# EAGLE design test2 (EAGLE 9.6.2)
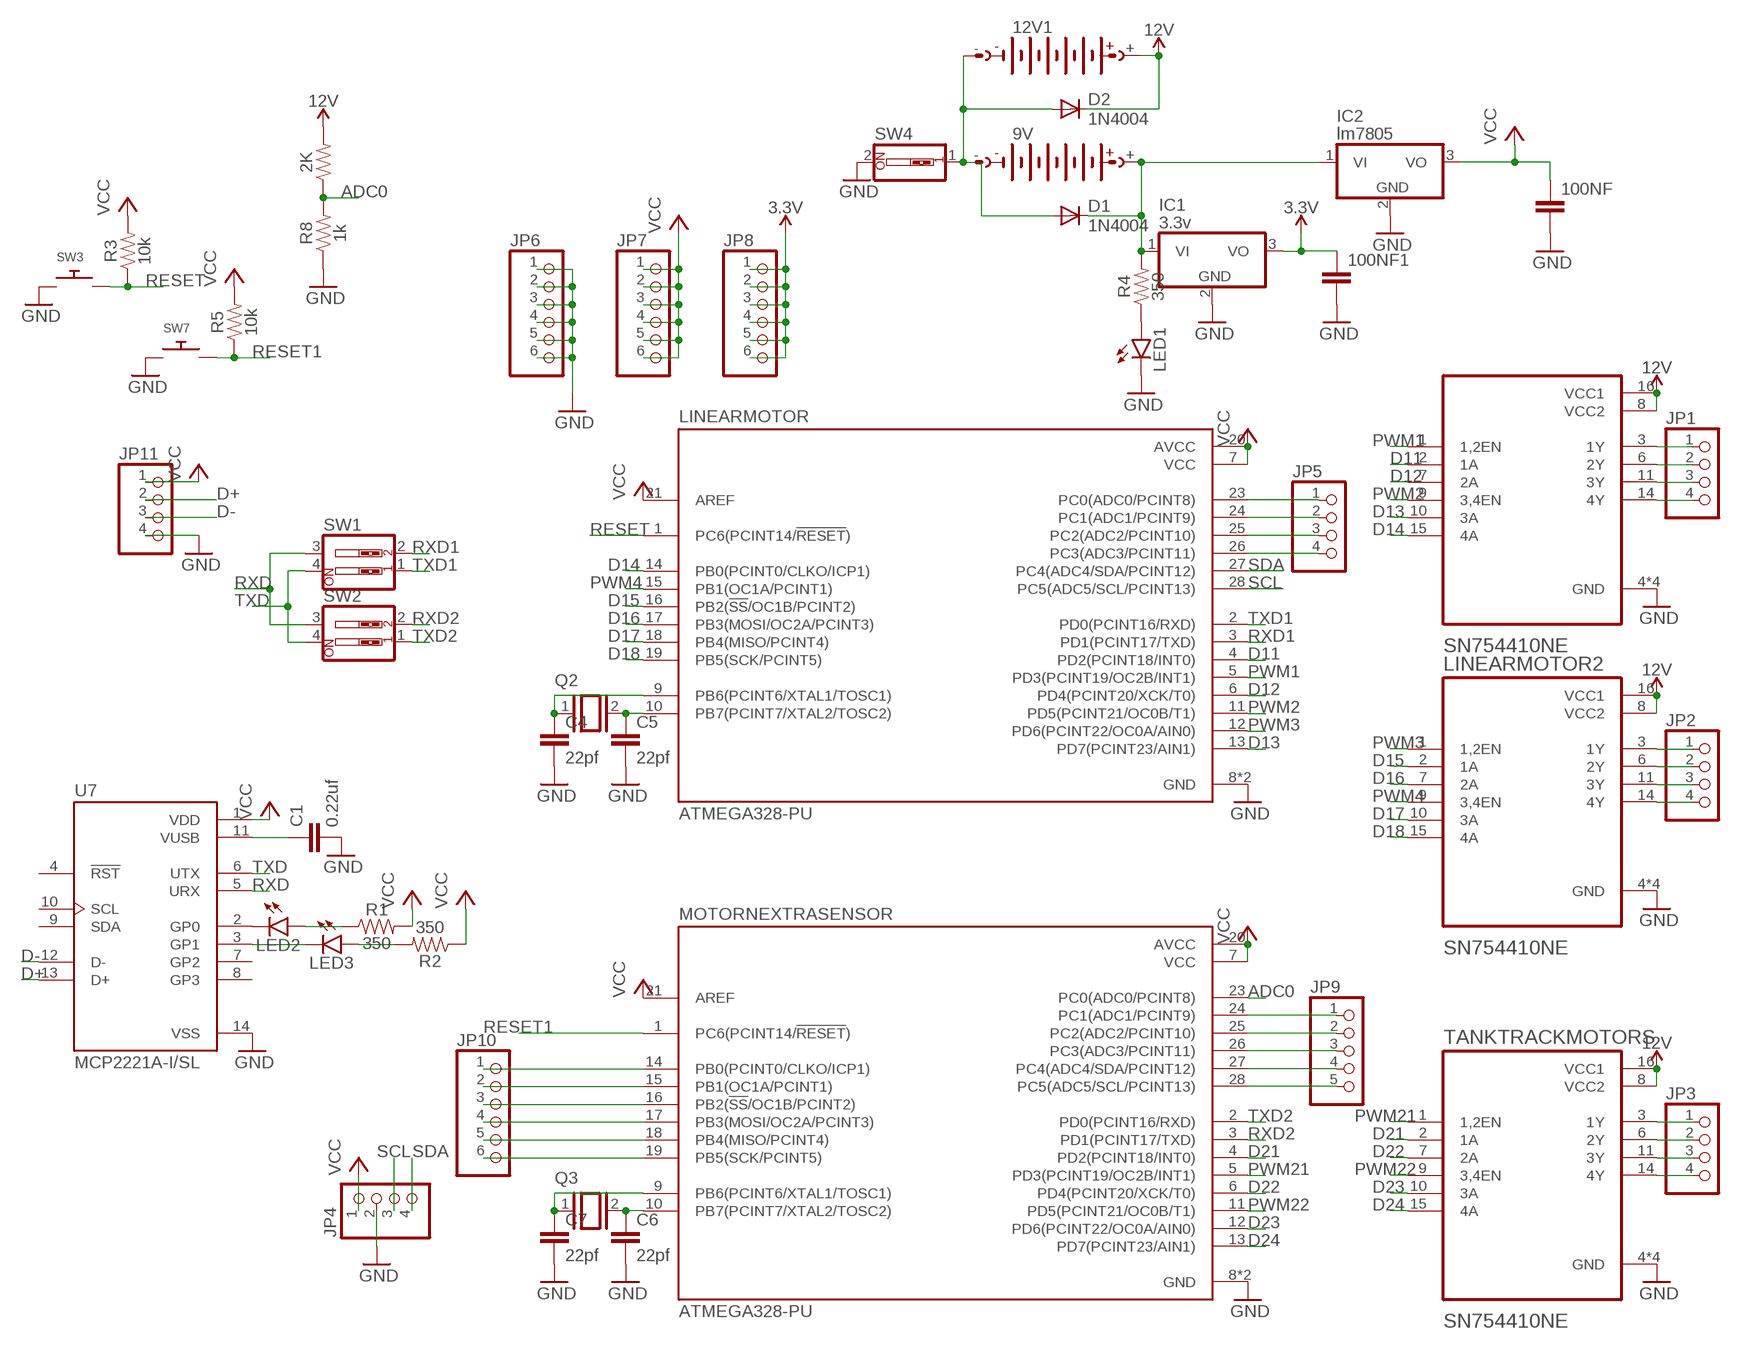
[diagram p0: schematic, sheet 1]

## Parts
2K  2k  1KOHM-HORIZ-1/4W-1%  [AXIAL-0.3]
9V  AB9V  [AB9V]
12V1  AB9V  [AB9V]
100NF  330nF  10NF-PTH-10MM-10000V-1-%  [CAP-PTH-10MM]
100NF1  330nF  10NF-PTH-10MM-10000V-1-%  [CAP-PTH-10MM]
C1  0.22uf  10NF-PTH-10MM-10000V-1-%  [CAP-PTH-10MM]
C4  22pf  10NF-PTH-10MM-10000V-1-%  [CAP-PTH-10MM]
C5  22pf  10NF-PTH-10MM-10000V-1-%  [CAP-PTH-10MM]
C6  22pf  10NF-PTH-10MM-10000V-1-%  [CAP-PTH-10MM]
C7  22pf  10NF-PTH-10MM-10000V-1-%  [CAP-PTH-10MM]
D1  1N4004  [DO41-10]
D2  1N4004  [DO41-10]
IC1  3.3v  788TV  [TO220V]
IC2  lm7805  788TV  [TO220V]
JP1  PINHD-1X4  [1X04]
JP2  PINHD-1X4  [1X04]
JP3  PINHD-1X4  [1X04]
JP4  PINHD-1X4  [1X04]
JP5  PINHD-1X4  [1X04]
JP6  PINHD-1X6  [1X06]
JP7  PINHD-1X6  [1X06]
JP8  PINHD-1X6  [1X06]
JP9  PINHD-1X5  [1X05]
JP10  PINHD-1X6  [1X06]
JP11  PINHD-1X4  [1X04]
LED1  LED3MM  [LED3MM]
LED2  LED3MM  [LED3MM]
LED3  LED3MM  [LED3MM]
LINEARMOTOR  ATMEGA328-PU  [DIP787W46P254L3467H508Q28]
LINEARMOTOR1  SN754410NE  [DIP762W45P254L1980H508Q16]
LINEARMOTOR2  SN754410NE  [DIP762W45P254L1980H508Q16]
MOTORNEXTRASENSOR  ATMEGA328-PU  [DIP787W46P254L3467H508Q28]
Q2  XTAL/S  [QS]
Q3  XTAL/S  [QS]
R1  350  1KOHM-HORIZ-1/4W-1%  [AXIAL-0.3]
R2  350  1KOHM-HORIZ-1/4W-1%  [AXIAL-0.3]
R3  10k  10KOHM-HORIZ-1/4W-1%  [AXIAL-0.3]
R4  350  1KOHM-HORIZ-1/4W-1%  [AXIAL-0.3]
R5  10k  10KOHM-HORIZ-1/4W-1%  [AXIAL-0.3]
R8  1k  1KOHM-HORIZ-1/4W-1%  [AXIAL-0.3]
SW1  SW_DIP-2  [EDG-02]
SW2  SW_DIP-2  [EDG-02]
SW3  SWITCH_PUSHBUTTONEVQ-PE  [TACT_PANA-EVQ]
SW4  SW_DIP-1  [EDG-01]
SW7  SWITCH_PUSHBUTTONEVQ-PE  [TACT_PANA-EVQ]
TANKTRACKMOTORS  SN754410NE  [DIP762W45P254L1980H508Q16]
U7  MCP2221A-I/SL  [SOIC127P600X175-14N]

## Nets
3.3V: 100NF1.1 IC1.3(VO) JP8.1 JP8.2 JP8.3 JP8.4 JP8.5 JP8.6
12V: 2K.P$2 12V1.+ D2.C LINEARMOTOR1.8(VCC2) LINEARMOTOR1.16(VCC1) LINEARMOTOR2.8(VCC2) LINEARMOTOR2.16(VCC1) TANKTRACKMOTORS.8(VCC2) TANKTRACKMOTORS.16(VCC1)
ADC0: 2K.P$1 MOTORNEXTRASENSOR.23(PC0(ADC0/PCINT8)) R8.P$2
D11: LINEARMOTOR1.2(1A) LINEARMOTOR.4(PD2(PCINT18/INT0))
D12: LINEARMOTOR1.7(2A) LINEARMOTOR.6(PD4(PCINT20/XCK/T0))
D13: LINEARMOTOR1.10(3A) LINEARMOTOR.13(PD7(PCINT23/AIN1))
D14: LINEARMOTOR1.15(4A) LINEARMOTOR.14(PB0(PCINT0/CLKO/ICP1))
D15: LINEARMOTOR2.2(1A) LINEARMOTOR.16(PB2(!SS!/OC1B/PCINT2))
D16: LINEARMOTOR2.7(2A) LINEARMOTOR.17(PB3(MOSI/OC2A/PCINT3))
D17: LINEARMOTOR2.10(3A) LINEARMOTOR.18(PB4(MISO/PCINT4))
D18: LINEARMOTOR2.15(4A) LINEARMOTOR.19(PB5(SCK/PCINT5))
D21: MOTORNEXTRASENSOR.4(PD2(PCINT18/INT0)) TANKTRACKMOTORS.2(1A)
D22: MOTORNEXTRASENSOR.6(PD4(PCINT20/XCK/T0)) TANKTRACKMOTORS.7(2A)
D23: MOTORNEXTRASENSOR.12(PD6(PCINT22/OC0A/AIN0)) TANKTRACKMOTORS.10(3A)
D24: MOTORNEXTRASENSOR.13(PD7(PCINT23/AIN1)) TANKTRACKMOTORS.15(4A)
D+: JP11.2 U7.13(D+)
D-: JP11.3 U7.12(D-)
GND: 100NF1.2 100NF.2 C1.2 C4.2 C5.2 C6.2 C7.2 IC1.2(GND) IC2.2(GND) JP4.2 JP6.1 JP6.2 JP6.3 JP6.4 JP6.5 JP6.6 JP11.4 LED1.K(C) LINEARMOTOR1.4(GND) LINEARMOTOR1.5(GND) LINEARMOTOR1.12(GND) LINEARMOTOR1.13(GND) LINEARMOTOR2.4(GND) LINEARMOTOR2.5(GND) LINEARMOTOR2.12(GND) LINEARMOTOR2.13(GND) LINEARMOTOR.8(GND) LINEARMOTOR.22(GND) MOTORNEXTRASENSOR.8(GND) MOTORNEXTRASENSOR.22(GND) R8.P$1 SW3.P$1 SW4.2 SW7.P$1 TANKTRACKMOTORS.4(GND) TANKTRACKMOTORS.5(GND) TANKTRACKMOTORS.12(GND) TANKTRACKMOTORS.13(GND) U7.14(VSS)
N$1: C1.1 U7.11(VUSB)
N$2: LED2.K(C) U7.2(GP0)
N$3: LED3.K(C) U7.3(GP1)
N$4: LED2.A R1.P$1
N$5: LED3.A R2.P$2
N$6: C6.1 MOTORNEXTRASENSOR.10(PB7(PCINT7/XTAL2/TOSC2)) Q3.2
N$7: C7.1 MOTORNEXTRASENSOR.9(PB6(PCINT6/XTAL1/TOSC1)) Q3.1
N$8: C4.1 LINEARMOTOR.9(PB6(PCINT6/XTAL1/TOSC1)) Q2.1
N$10: JP9.1 MOTORNEXTRASENSOR.24(PC1(ADC1/PCINT9))
N$11: C5.1 LINEARMOTOR.10(PB7(PCINT7/XTAL2/TOSC2)) Q2.2
N$12: JP1.1 LINEARMOTOR1.3(1Y)
N$13: JP1.2 LINEARMOTOR1.6(2Y)
N$14: JP1.3 LINEARMOTOR1.11(3Y)
N$15: JP1.4 LINEARMOTOR1.14(4Y)
N$16: JP2.1 LINEARMOTOR2.3(1Y)
N$17: JP2.2 LINEARMOTOR2.6(2Y)
N$18: JP2.3 LINEARMOTOR2.11(3Y)
N$19: JP2.4 LINEARMOTOR2.14(4Y)
N$20: JP3.1 TANKTRACKMOTORS.3(1Y)
N$21: JP3.2 TANKTRACKMOTORS.6(2Y)
N$22: JP3.3 TANKTRACKMOTORS.11(3Y)
N$23: JP3.4 TANKTRACKMOTORS.14(4Y)
N$24: JP5.1 LINEARMOTOR.23(PC0(ADC0/PCINT8))
N$25: JP5.2 LINEARMOTOR.24(PC1(ADC1/PCINT9))
N$26: JP5.3 LINEARMOTOR.25(PC2(ADC2/PCINT10))
N$27: JP5.4 LINEARMOTOR.26(PC3(ADC3/PCINT11))
N$28: JP9.2 MOTORNEXTRASENSOR.25(PC2(ADC2/PCINT10))
N$29: JP9.3 MOTORNEXTRASENSOR.26(PC3(ADC3/PCINT11))
N$30: JP10.1 MOTORNEXTRASENSOR.14(PB0(PCINT0/CLKO/ICP1))
N$31: JP10.2 MOTORNEXTRASENSOR.15(PB1(OC1A/PCINT1))
N$32: JP10.3 MOTORNEXTRASENSOR.16(PB2(!SS!/OC1B/PCINT2))
N$33: JP10.4 MOTORNEXTRASENSOR.17(PB3(MOSI/OC2A/PCINT3))
N$34: JP10.5 MOTORNEXTRASENSOR.18(PB4(MISO/PCINT4))
N$35: JP9.4 MOTORNEXTRASENSOR.27(PC4(ADC4/SDA/PCINT12))
N$36: JP9.5 MOTORNEXTRASENSOR.28(PC5(ADC5/SCL/PCINT13))
N$37: 9V.+ D1.C IC1.1(VI) IC2.1(VI) R4.P$2
N$38: JP10.6 MOTORNEXTRASENSOR.19(PB5(SCK/PCINT5))
N$40: LED1.A R4.P$1
N$41: 9V.- 12V1.- D1.A D2.A SW4.1
PWM1: LINEARMOTOR1.1(1,2EN) LINEARMOTOR.5(PD3(PCINT19/OC2B/INT1))
PWM2: LINEARMOTOR1.9(3,4EN) LINEARMOTOR.11(PD5(PCINT21/OC0B/T1))
PWM3: LINEARMOTOR2.1(1,2EN) LINEARMOTOR.12(PD6(PCINT22/OC0A/AIN0))
PWM4: LINEARMOTOR2.9(3,4EN) LINEARMOTOR.15(PB1(OC1A/PCINT1))
PWM21: MOTORNEXTRASENSOR.5(PD3(PCINT19/OC2B/INT1)) TANKTRACKMOTORS.1(1,2EN)
PWM22: MOTORNEXTRASENSOR.11(PD5(PCINT21/OC0B/T1)) TANKTRACKMOTORS.9(3,4EN)
RESET: LINEARMOTOR.1(PC6(PCINT14/!RESET!)) R3.P$1 SW3.P$2
RESET1: MOTORNEXTRASENSOR.1(PC6(PCINT14/!RESET!)) R5.P$1 SW7.P$2
RXD: SW1.3 SW2.3 U7.5(URX)
RXD1: LINEARMOTOR.3(PD1(PCINT17/TXD)) SW1.2
RXD2: MOTORNEXTRASENSOR.3(PD1(PCINT17/TXD)) SW2.2
SCL: JP4.3 LINEARMOTOR.28(PC5(ADC5/SCL/PCINT13))
SDA: JP4.4 LINEARMOTOR.27(PC4(ADC4/SDA/PCINT12))
TXD: SW1.4 SW2.4 U7.6(UTX)
TXD1: LINEARMOTOR.2(PD0(PCINT16/RXD)) SW1.1
TXD2: MOTORNEXTRASENSOR.2(PD0(PCINT16/RXD)) SW2.1
VCC: 100NF.1 IC2.3(VO) JP4.1 JP7.1 JP7.2 JP7.3 JP7.4 JP7.5 JP7.6 JP11.1 LINEARMOTOR.7(VCC) LINEARMOTOR.20(AVCC) LINEARMOTOR.21(AREF) MOTORNEXTRASENSOR.7(VCC) MOTORNEXTRASENSOR.20(AVCC) MOTORNEXTRASENSOR.21(AREF) R1.P$2 R2.P$1 R3.P$2 R5.P$2 U7.1(VDD)
Unconnected: U7.4(!RST) U7.7(GP2) U7.8(GP3) U7.9(SDA) U7.10(SCL)

## Library data of the parts
2K R1 R2 R4 = SparkFun-Resistors:1KOHM: 1kΩ resistor A resistor is a passive two-terminal electrical component that implements electrical resistance as a circuit element. Resistors act to reduce current flow, and, at the same time, act to lower voltage levels within circuits. - Wikipedia; PROD_ID: RES-12182; VALUE: 1k
9V 12V1 = battery:AB9V: 9-V BATTERY CLIP
100NF 100NF1 C1 C4-C7 = SparkFun-Capacitors:10NF: 0.01uF/10nF/10,000pF ceramic capacitors A capacitor is a passive two-terminal electrical component used to store electrical energy temporarily in an electric field. CAP-09321; PROD_ID: CAP-09321; VALUE: 10nF
D1 D2 = adafruit:1N4004: DIODE General purpose 1N400x type rectifier (With bigger pads) http://www.ladyada.net/library/pcb/eaglelibrary.html
IC1 IC2 = linear:78*: Positive VOLTAGE REGULATOR Source: http://cache.national.com/ds/LM/LM78L05.pdf http://www.fairchildsemi.com/ds/LM/LM7805.pdf
JP1-JP5 JP11 = pinhead:PINHD-1X4: PIN HEADER
JP6-JP8 JP10 = pinhead:PINHD-1X6: PIN HEADER
JP9 = pinhead:PINHD-1X5: PIN HEADER
LED1-LED3 = led:LED: LED OSRAM: - CHIPLED LG R971, LG N971, LY N971, LG Q971, LY Q971, LO R971, LY R971 LH N974, LH R974 LS Q976, LO Q976, LY Q976 LO Q996 - Hyper CHIPLED LW Q18S LB Q993, LB Q99A, LB R99A - SideLED LS A670, LO A670, LY A670, LG A670, LP A670 LB A673, LV A673, LT A673, LW A673 LH A674 LY A675 LS A676, LA A676, LO A676, LY A676, LW A676 LS A679, LY A679, LG A679 - Hyper Micro SIDELED® LS Y876, LA Y876, LO Y876, LY Y876 LT Y87S - SmartLED LW L88C, LW L88S LB L89C, LB L89S, LG L890 LS L89K, LO L89K, LY L89K LS L896, LA L896, LO L896, LY L896 - TOPLED LS T670, LO T670, LY T670, LG T670, LP T670 LSG T670, LSP T670, LSY T670, LOP T670, LYG T670 LG T671, LOG T671, LSG T671 LB T673, LV T673, LT T673, LW T673 LH T674 LS T676, LA T676, LO T676, LY T676, LB T676, LH T676, LSB T676, LW T676 LB T67C, LV T67C, LT T67C, LS T67K, LO T67K, LY T67K, LW E67C LS E67B, LA E67B, LO E67B, LY E67B, LB E67C, LV E67C, LT E67C LW T67C LS T679, LY T679, LG T679 LS T770, LO T770, LY T770, LG T770, LP T770 LB T773, LV T773, LT T773, LW T773 LH T774 LS E675, LA E675, LY E675, LS T675 LS T776, LA T776, LO T776, LY T776, LB T776 LHGB T686 LT T68C, LB T68C - Hyper Mini TOPLED® LB M676 - Mini TOPLED Santana® LG M470 LS M47K, LO M47K, LY M47K Source: http://www.osram.convergy.de LUXEON: - LUMILED® LXK2-PW12-R00, LXK2-PW12-S00, LXK2-PW14-U00, LXK2-PW14-V00 LXK2-PM12-R00, LXK2-PM12-S00, LXK2-PM14-U00 LXK2-PE12-Q00, LXK2-PE12-R00, LXK2-PE12-S00, LXK2-PE14-T00, LXK2-PE14-U00 LXK2-PB12-K00, LXK2-PB12-L00, LXK2-PB12-M00, LXK2-PB14-N00, LXK2-PB14-P00, LXK2-PB14-Q00 LXK2-PR12-L00, LXK2-PR12-M00, LXK2-PR14-Q00, LXK2-PR14-R00 LXK2-PD12-Q00, LXK2-PD12-R00, LXK2-PD12-S00 LXK2-PH12-R00, LXK2-PH12-S00 LXK2-PL12-P00, LXK2-PL12-Q00, LXK2-PL12-R00 Source: www.luxeon.com KINGBRIGHT: KA-3528ASYC Source: www.kingbright.com
LINEARMOTOR MOTORNEXTRASENSOR = ATMEGA328-PU:ATMEGA328-PU: Check availability <https://pricing.snapeda.com/parts/ATMEGA328-PU/Microchip%20Technology/view-part?ref=eda>; AVAILABILITY: In Stock; CHECK_PRICES: https://www.snapeda.com/parts/ATMEGA328-PU/Microchip/view-part/?ref=eda; DESCRIPTION: AVR AVR® ATmega Microcontroller IC 8-Bit 20MHz 32KB (16K x 16) FLASH 28-PDIP; MF: Microchip Technology; MP: ATMEGA328-PU; PACKAGE: DIP-28 Microchip Technology; PRICE: None; PURCHASE-URL: https://www.snapeda.com/api/url_track_click_mouser/?unipart_id=4833845&manufacturer=Microchip Technology&part_name=ATMEGA328-PU&search_term=None; SNAPEDA_LINK: https://www.snapeda.com/parts/ATMEGA328-PU/Microchip/view-part/?ref=snap
LINEARMOTOR1 LINEARMOTOR2 TANKTRACKMOTORS = SN754410NE:SN754410NE: Check availability <https://pricing.snapeda.com/parts/SN754410NE/Texas%20Instruments/view-part?ref=eda>; AVAILABILITY: In Stock; CHECK_PRICES: https://www.snapeda.com/parts/SN754410NE/Texas+Instruments/view-part/?ref=eda; DESCRIPTION: Quadruple Half-H Drivers; MF: Texas Instruments; MP: SN754410NE; PACKAGE: PDIP-16 Texas Instruments; PRICE: None; PURCHASE-URL: https://www.snapeda.com/api/url_track_click_mouser/?unipart_id=285165&manufacturer=Texas Instruments&part_name=SN754410NE&search_term=None; SNAPEDA_LINK: https://www.snapeda.com/parts/SN754410NE/Texas+Instruments/view-part/?ref=snap
Q2 Q3 = special:XTAL/S: CRYSTAL
R3 R5 = SparkFun-Resistors:10KOHM: 10kΩ resistor A resistor is a passive two-terminal electrical component that implements electrical resistance as a circuit element. Resistors act to reduce current flow, and, at the same time, act to lower voltage levels within circuits. - Wikipedia; PROD_ID: RES-12183
R8 = SparkFun-Resistors:1KOHM: 1kΩ resistor A resistor is a passive two-terminal electrical component that implements electrical resistance as a circuit element. Resistors act to reduce current flow, and, at the same time, act to lower voltage levels within circuits. - Wikipedia; PROD_ID: RES-12182
SW1 SW2 = special:SW_DIP-2: DIP SWITCH
SW3 SW7 = adafruit:SWITCH_PUSHBUTTON: Buttons SOFTTOUCHSMD_SJ - Soft touch temporary push button (Super Junk Akihabara) Compatible with SKPMANE010 [Mouser: 688-SKPMAN] C&K_KSS = Digikey: KSS221GLFS
SW4 = special:SW_DIP-1: DIP SWITCH
U7 = MCP2221A-I_SL:MCP2221A-I/SL: USB 2.0-to-I2C/UART/SMBus Protocol Converter with GPIO (Master Mode) Check availability <https://pricing.snapeda.com/parts/MCP2221A-I/SL/Microchip/view-part?ref=eda>; AVAILABILITY: In Stock; CHECK_PRICES: https://www.snapeda.com/parts/MCP2221A-I/SL/Microchip/view-part/?ref=eda; DESCRIPTION: USB Bridge, USB to I²C/UART USB 2.0 I²C, UART Interface 14-SOIC; MF: Microchip; MP: MCP2221A-I/SL; PACKAGE: SO-14 Microchip; PRICE: None; PURCHASE-URL: https://www.snapeda.com/api/url_track_click_mouser/?unipart_id=561316&manufacturer=Microchip&part_name=MCP2221A-I/SL&search_term=None; SNAPEDA_LINK: https://www.snapeda.com/parts/MCP2221A-I/SL/Microchip/view-part/?ref=snap

## Board
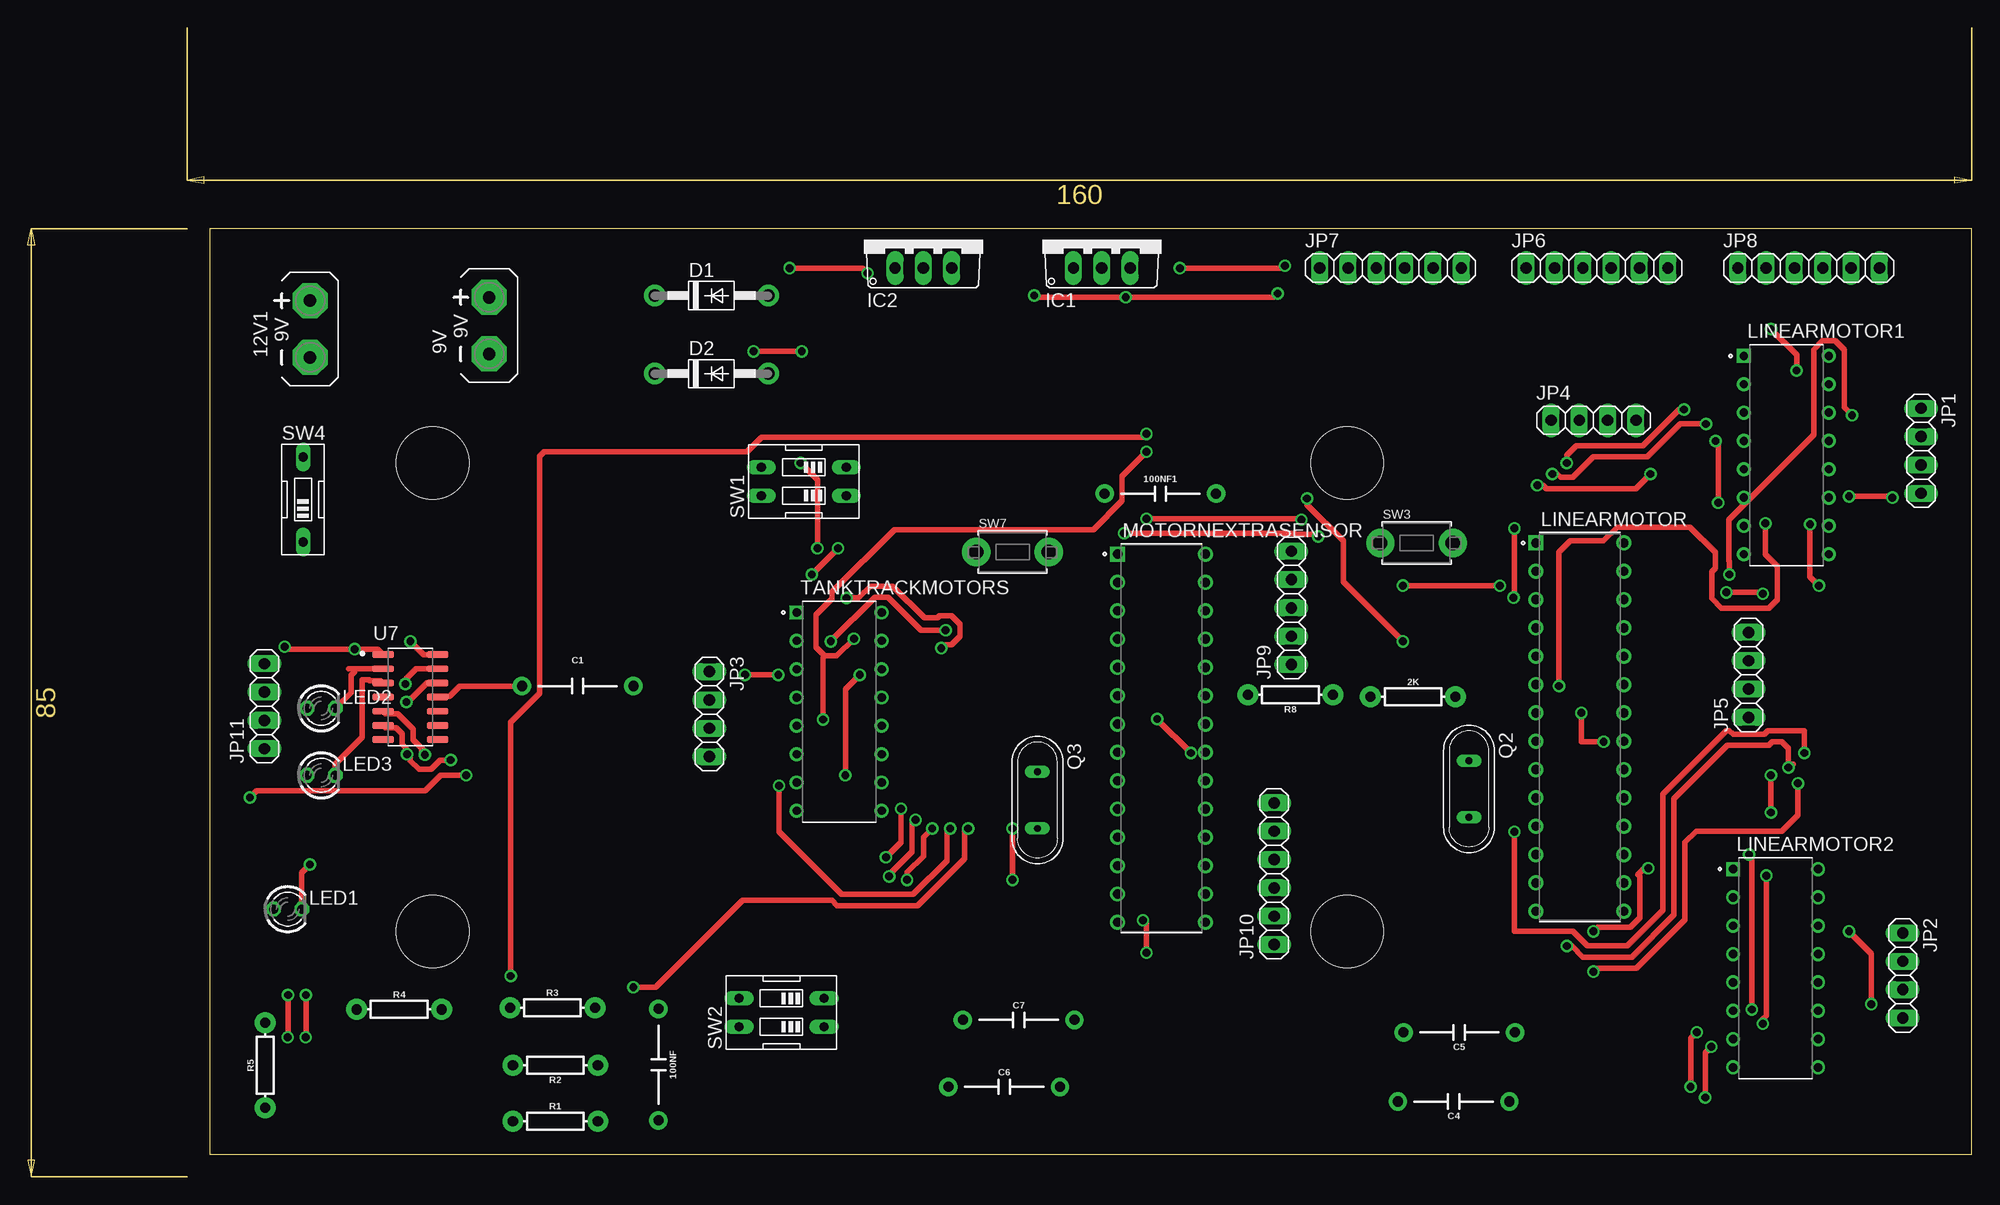
[diagram p1: board, top side]
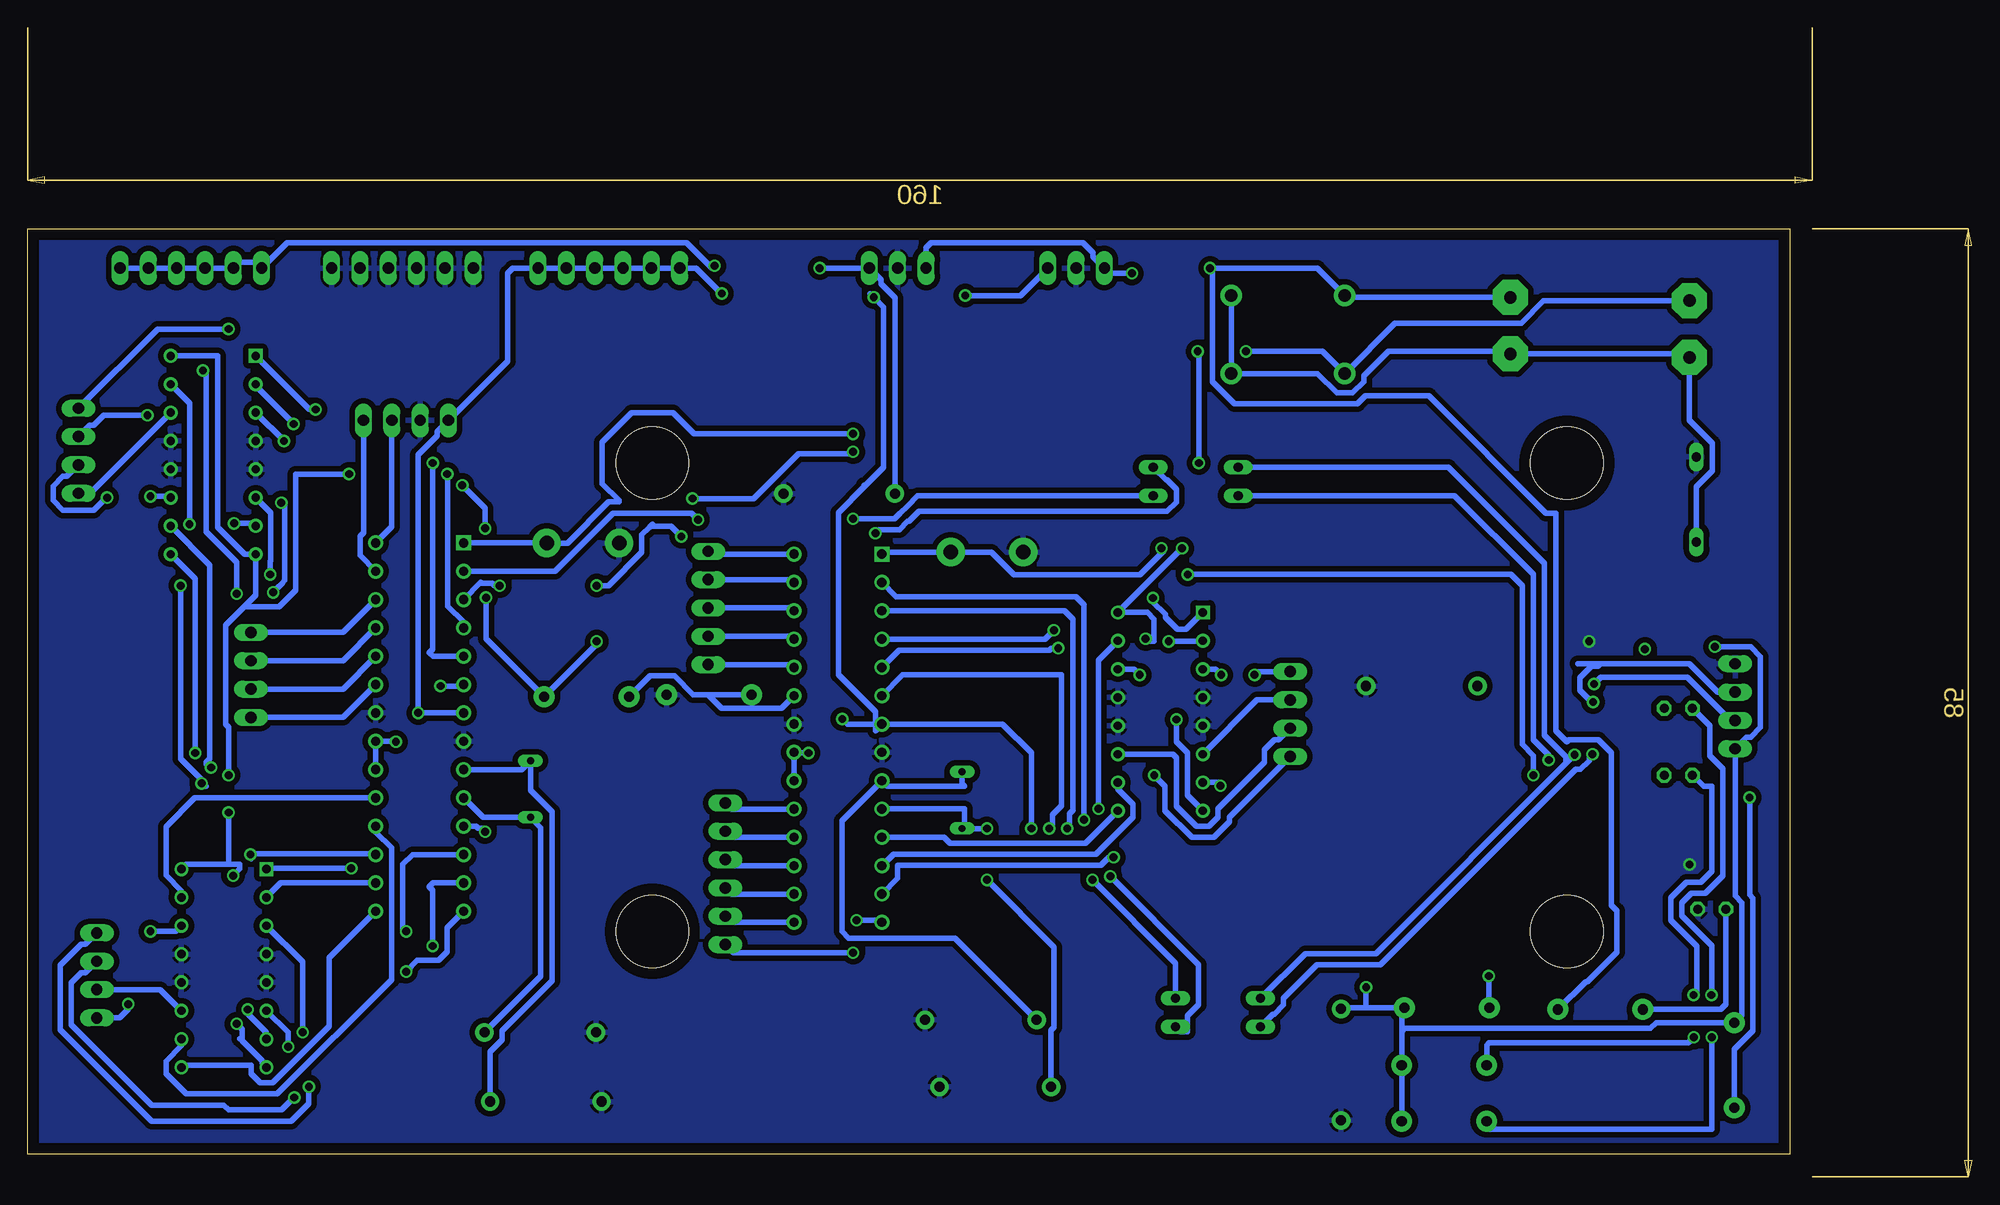
[diagram p2: board, bottom side, seen from below]

Size 158 x 83 mm. Coordinates in mm from the lower left corner, seen from the top.
Outline: 0,0 158,0 158,83 0,83 0,0
Copper layers (1*16): Top 0.035mm / dielectric 1.5mm / Bottom 0.035mm
Design rules "UWE_Router_Std_SS&DS": minimum track width 0.5mm, minimum drill 0.7mm, track to track 0.5mm, track to pad 0.5mm, pad to pad 0.5mm, via to via 0.5mm, smd to smd 0.5mm, copper to edge 1mm, drill to drill 0.2mm, minimum pad ring 10mil, minimum via ring 8mil, stop-mask expansion 4mil, vias tented up to drill 0mil, thermal gap 0.25mm
Holes 6.5 mm at 102,62 20,62 20,20 102,20

### Footprints (pad centres in the part's own frame; a part is rotated, then mirrored left to right if it is on the bottom)
AXIAL-0.3 = drill 0.9 pad 1.88: P$1 -3.81,0; P$2 3.81,0
AB9V = drill 1.118 pad 3.15 octagon: + 0,2.54; - 0,-2.54
CAP-PTH-10MM = drill 0.9 pad 1.651: 1 -5,0; 2 5,0
DO41-10 = drill 1.118 pad 1.93: A 5.08,0; C -5.08,0
TO220V = drill 1.016 long: 1 -2.54,-2.54; 2 0,-2.54; 3 2.54,-2.54
1X04 = drill 1.016 long: 1 -3.81,0; 2 -1.27,0; 3 1.27,0; 4 3.81,0
1X06 = drill 1.016 long: 1 -6.35,0; 2 -3.81,0; 3 -1.27,0; 4 1.27,0; 5 3.81,0; 6 6.35,0
1X05 = drill 1.016 long: 1 -5.08,0; 2 -2.54,0; 3 0,0; 4 2.54,0; 5 5.08,0
LED3MM = drill 0.813 octagon: A -1.27,0; K 1.27,0
DIP787W46P254L3467H508Q28 = drill 0.83 pad 1.25 square: 1 -3.937,16.51 | drill 0.83 pad 1.25: 2 -3.937,13.97; 3 -3.937,11.43; 4 -3.937,8.89; 5 -3.937,6.35; 6 -3.937,3.81; 7 -3.937,1.27; 8 -3.937,-1.27; 9 -3.937,-3.81; 10 -3.937,-6.35; 11 -3.937,-8.89; 12 -3.937,-11.43; 13 -3.937,-13.97; 14 -3.937,-16.51; 15 3.937,-16.51; 16 3.937,-13.97; 17 3.937,-11.43; 18 3.937,-8.89; 19 3.937,-6.35; 20 3.937,-3.81; 21 3.937,-1.27; 22 3.937,1.27; 23 3.937,3.81; 24 3.937,6.35; 25 3.937,8.89; 26 3.937,11.43; 27 3.937,13.97; 28 3.937,16.51
DIP762W45P254L1980H508Q16 = drill 0.74 square: 1 -3.81,8.89 | drill 0.74: 2 -3.81,6.35; 3 -3.81,3.81; 4 -3.81,1.27; 5 -3.81,-1.27; 6 -3.81,-3.81; 7 -3.81,-6.35; 8 -3.81,-8.89; 9 3.81,-8.89; 10 3.81,-6.35; 11 3.81,-3.81; 12 3.81,-1.27; 13 3.81,1.27; 14 3.81,3.81; 15 3.81,6.35; 16 3.81,8.89
QS = drill 0.61 long: 1 -2.54,0; 2 2.54,0
EDG-02 = drill 0.813 long: 1 -1.27,-3.81; 2 1.27,-3.81; 3 1.27,3.81; 4 -1.27,3.81
TACT_PANA-EVQ = drill 1.3 pad 2.54: P$1 -3.25,0; P$2 3.25,0
EDG-01 = drill 0.813 long: 1 0,-3.81; 2 0,3.81
SOIC127P600X175-14N = smd 1.91 x 0.6: 1 -2.46,3.81; 2 -2.46,2.54; 3 -2.46,1.27; 4 -2.46,0; 5 -2.46,-1.27; 6 -2.46,-2.54; 7 -2.46,-3.81; 8 2.46,-3.81; 9 2.46,-2.54; 10 2.46,-1.27; 11 2.46,0; 12 2.46,1.27; 13 2.46,2.54; 14 2.46,3.81

### Placement (x,y rotation side)
2K  107.91,41.03 0 top
9V  25.06,74.31 0 top
12V1  9,74 0 top
100NF  40.25,8.05 270 top
100NF1  85.25,59.25 0 top
C1  33,42 0 top
C4  111.55,4.75 180 top
C5  112.05,10.94 180 top
C6  71.25,6.06 0 top
C7  72.55,12.06 0 top
D1  45,77 0 top
D2  45,70 0 top
IC1  80,82 0 top
IC2  64,82 0 top
JP1  153.47,63.09 270 top
JP2  151.82,16.05 270 top
JP3  44.82,39.48 270 top
JP4  124.09,65.82 0 top
JP5  138,43 90 top
JP6  124.41,79.47 0 top
JP7  105.9,79.47 0 top
JP8  143.39,79.47 0 top
JP9  97,49 90 top
JP10  95.45,25.17 90 top
JP11  4.91,40.19 90 top
LED1  7,22 0 top
LED2  10,40 0 top
LED3  10,34 0 top
LINEARMOTOR  122.87,38.32 0 top
LINEARMOTOR1  141.39,62.7 0 top
LINEARMOTOR2  140.42,16.7 0 top
MOTORNEXTRASENSOR  85.36,37.32 0 top
Q2  112.93,32.77 270 top
Q3  74.23,31.77 270 top
R1  31,3 0 top
R2  31,8 180 top
R3  30.74,13.17 0 top
R4  17,13 0 top
R5  5,8 90 top
R8  96.91,41.22 180 top
SW1  53.28,60.34 90 top
SW2  51.28,12.72 90 top
SW3  108.23,54.82 0 top
SW4  8.37,58.72 0 top
SW7  72,54 0 top
TANKTRACKMOTORS  56.45,39.7 0 top
U7  18,41 0 top

### Tracks (layer width: path | path; a pad name or v marks a point on that pad's centre or on a via)
3.3V  (via drill 0.7)
  Top 0.5: v87,79.46 96.21,79.46 v96.42,79.67
  Bottom 0.5: JP8.6 JP8.5 JP8.4 JP8.3 JP8.2 140,79.89 140,80 137.57,80 JP8.1 134.76,81.75 100.75,81.75 100.74,81.74 98.92,81.74 96.64,79.46 v96.42,79.67 | 100NF1.1 80.25,76.81 81.51,78.07 81.51,78.43 IC1.3 v87,79.46
12V  (via drill 0.7)
  Top 0.5: v48.78,72 v53.1,72 | v140,34 v140,30.67 | v119.05,60 119.55,60 119.85,59.7 127.9,59.7 v129.2,61 | v117,56.13 117,50 v116.92,49.92 | v98.4,58.8 98.4,58.25 101.66,55 101.66,51.34 v107,46 | v84,63 81.83,60.83 81.83,58.6 79.25,56.02 61.4,56.02 55.81,50.43 55.81,49.81 54.39,48.39 54.39,45.46 55.16,44.7 | 55.16,44.7 56.24,44.7 v57.77,46.23 | 55.16,44.7 55,44.54 v55,39 | v139.28,11.72 139.28,12.15 139.59,12.46 v139.59,25 | v54.5,54.35 54.5,60.5 v53,62
  Bottom 0.5: 12V1.+ 22.08,76.54 24.1,74.53 35.4,74.53 D2.C 41.92,72 v48.78,72 | v53.1,72 53,71.9 v53,62 | TANKTRACKMOTORS.8 54.01,32.18 54.01,36 55.01,37 55.01,38.99 v55,39 | LINEARMOTOR2.8 136.98,8.18 136.98,8.4 138.79,10.21 | 138.79,10.21 138.98,10.4 | 140,26 138.98,26 138.98,25.61 v139.59,25 | 140,26 143.82,26 LINEARMOTOR2.16 | 138.62,49.09 137.58,50.13 LINEARMOTOR1.8 138.58,53.81 141,56.23 141,71.59 LINEARMOTOR1.16 | 138.62,49.09 140.27,47.44 140.27,38.56 140,38.29 v140,34 | v140,30.67 140,26 | 138.62,49.09 135.46,49.09 133.97,50.58 133.97,61 v129.2,61 | v119.05,60 117,57.95 v117,56.13 | v116.92,49.92 116.92,46.23 2K.P$2 107,45.75 v107,46 | v98.4,58.8 92.92,58.8 88.9,62.83 84.17,62.83 v84,63 | v57.77,46.23 57.54,46 57,46 57,48 57.59,48.59 TANKTRACKMOTORS.16 v54.5,54.35 | 138.79,10.21 138.79,11.23 v139.28,11.72
ADC0
  Bottom 0.5: R8.P$2 97,41.22 | 97,41.22 98.33,41.22 100.02,42.91 102.22,42.91 2K.P$1 | 97,41.22 95.78,40 90.43,40 MOTORNEXTRASENSOR.23
D11  (via drill 0.7)
  Top 0.5: v120.39,61 120.85,61 121.16,60.7 122,60.7 122.24,60.7 124.09,62.55 128.94,62.55 131.89,65.49 v134.17,65.49
  Bottom 0.5: LINEARMOTOR.4 118.93,47.74 120.35,49.16 120.35,60.96 v120.39,61 | LINEARMOTOR1.2 137.58,68.9 v134.17,65.49
D12  (via drill 0.7)
  Top 0.5: v139.51,56.58 139.51,53.82 140.58,52.75 140.58,49.74 139.82,48.97 135.58,48.97 134.7,49.85 134.7,52.26 135,52.57 135,54 132.75,56.25 126.22,56.25 124.97,55 122,55 121,54 v121,42
  Bottom 0.5: LINEARMOTOR1.7 137.35,56.58 v139.51,56.58 | v121,42 119.06,42 LINEARMOTOR.6
D13  (via drill 0.7)
  Top 0.5: 142,35 141.88,35 v141.57,34.7 141.57,36.42 141,37 140.12,37 139.8,36.68 136.09,36.68 131.3,31.89 131.3,21.47 127.53,17.7 123.13,17.7 122.13,18.7 v121.7,18.7
  Bottom 0.5: v141.57,34.7 141.7,34.7 142,35 142,35.16 141.7,35.46 141.7,52.85 LINEARMOTOR1.10 | v121.7,18.7 121.7,23.7 122,24 121.65,24.35 LINEARMOTOR.13
D14  (via drill 0.7)
  Top 0.5: v124.08,16.39 124.39,16.7 127.94,16.7 132.3,21.06 132.3,28 133.3,29 141,29 142.42,30.42 v142.42,33.27 | v143.5,56.5 143.5,51.8 v144.3,51
  Bottom 0.5: 119,22 119,21.88 LINEARMOTOR.14 120.4,20.34 120.4,18.16 121.16,17.39 123.08,17.39 v124.08,16.39 | v142.42,33.27 142.15,33 | 142.15,33 142,33 | LINEARMOTOR1.15 143.5,67.35 v143.5,56.5 | v144.3,51 144.3,35.46 142.15,33.31 142.15,33
D15
  Bottom 0.5: LINEARMOTOR.16 135.31,24.35 LINEARMOTOR2.2
D16  (via drill 0.7)
  Top 0.5: v138.29,13 138.29,26.65 v138.04,26.9
  Bottom 0.5: 137.98,26.52 137.61,26.9 | LINEARMOTOR2.7 136.61,10.95 137.83,12.17 137.98,12.32 138.29,12.62 v138.29,13 | LINEARMOTOR.17 126.88,26.96 137,26.96 137.54,26.96 137.61,26.9 | v138.04,26.9 137.61,26.9
D17
  Bottom 0.5: LINEARMOTOR.18 126.81,28.9 125.39,27.48 125.39,15.68 135.63,5.44 143.8,5.44 145.6,7.24 145.6,8.38 144.23,9.75 LINEARMOTOR2.10
D18
  Bottom 0.5: LINEARMOTOR2.15 144.23,23.65 145.6,25.02 145.6,29.4 143.03,31.97 LINEARMOTOR.19
D21  (via drill 0.7)
  Top 0.5: v66,47 63.79,47 60.83,49.96 59.66,49.96 v55.7,46
  Bottom 0.5: MOTORNEXTRASENSOR.4 66.79,46.21 v66,47 | v55.7,46 52.69,46 TANKTRACKMOTORS.2
D22  (via drill 0.7)
  Top 0.5: v51.05,33.05 51.05,28.95 56.69,23.32 63.08,23.32 66.1,26.34 66.1,28.92 v66.41,29.22
  Bottom 0.5: TANKTRACKMOTORS.7 51.35,33.35 v51.05,33.05 | v66.41,29.22 66.1,29.53 66.1,30.46 65.3,31.26 65.3,43 79.55,43 MOTORNEXTRASENSOR.6
D23
  Bottom 0.5: TANKTRACKMOTORS.10 60.26,32.75 58.89,31.38 58.89,30.24 62.21,26.92 80.39,26.92 MOTORNEXTRASENSOR.12
D24  (via drill 0.7)
  Top 0.5: v60.64,26.64 62,28 v62,31
  Bottom 0.5: MOTORNEXTRASENSOR.13 80,24.77 80,25.9 79.98,25.92 61.79,25.92 61.07,26.64 v60.64,26.64 | v62,31 62,44.31 TANKTRACKMOTORS.15
D+  (via drill 0.7)
  Top 0.5: v17.55,42.18 17.6,42.23 17.6,42.64 18.5,43.54 U7.13
  Bottom 0.5: JP11.2 5.33,38.92 9.21,42.79 16.93,42.79 v17.55,42.18
D-  (via drill 0.7)
  Top 0.5: v17.64,40.57 17.95,40.88 18.09,40.88 19.11,41.89 19.31,42.1 19.48,42.27 U7.12
  Bottom 0.5: JP11.3 6.46,41.46 9,44 17,44 | 17,44 19,44 | 17,44 17.21,43.79 17.78,43.79 18.85,42.72 18.85,41.64 18.09,40.88 17.95,40.88 v17.64,40.57
GND  (via drill 0.7)
  Top 0.5: v18,46 19.19,44.81 U7.14 | LED1.K 8.27,25.27 v9,26
  pour Bottom: -3,84 -3,-4 160,-4 160,85 -3,85
N$1
  Top 0.5: U7.11 20.56,41.1 21.52,41.1 22.42,42 C1.1
N$2
  Top 0.5: U7.2 13,43.54 | 13,43.54 12.46,43.54 | 11,40.27 LED2.K 12.68,41.41 12.68,42.95 13,43.27 13,43.54
N$3
  Top 0.5: LED3.K 11.27,35.01 13.68,37.42 13.68,42.54 14.31,42.54 14.36,42.49 15.32,42.49 U7.3
N$4  (via drill 0.7)
  Top 0.5: v7.03,14.3 7.03,10.54 v7,10.51
  Bottom 0.5: LED2.A 7.18,38.45 7.18,35.75 6,34.57 6,25 7.59,23.41 8.85,23.41 9.68,22.58 9.68,21.42 7,18.73 7,14.34 v7.03,14.3 | v7,10.51 7,2.25 27.19,2.25 R1.P$1
N$5  (via drill 0.7)
  Top 0.5: v8.64,14.3 8.64,10.54 v8.61,10.51
  Bottom 0.5: LED3.A 7.73,33 7,33 7,25.41 8,24.41 9.27,24.41 10.68,23 10.68,21 8.34,18.66 8.34,14.6 v8.64,14.3 | v8.61,10.51 9.11,10 27,10 27.19,9.81 R2.P$2
N$6  (via drill 0.7)
  Top 0.5: v72,24.62 v72,29.22
  Bottom 0.5: MOTORNEXTRASENSOR.10 81.39,31 74,31 74,29.46 Q3.2 v72,29.22 | C6.1 66.25,11.13 65.97,11.41 65.97,18.59 v72,24.62
N$7
  Bottom 0.5: Q3.1 74.23,33.23 74,33 80.91,33 MOTORNEXTRASENSOR.9 85,29.93 85,20 84.39,19.39 74.88,19.39 C7.1
N$8
  Bottom 0.5: LINEARMOTOR.9 113.73,34.51 Q2.1 112.93,32.64 111,30.71 111,15.59 115.47,11.11 115.47,10.29 116.55,9.21 C4.1
N$10
  Bottom 0.5: JP9.1 89.55,43.92 MOTORNEXTRASENSOR.24
N$11
  Bottom 0.5: C5.1 112,16 112,29.3 Q2.2 117.19,30.23 LINEARMOTOR.10
N$12  (via drill 0.7)
  Top 0.5: v136,50.39 139.16,50.39 v139.28,50.28 | v142.3,70.29 142.3,71.7 v140,74 | v135.28,58.43 135.28,63.72 v135.03,63.97
  Bottom 0.5: 135.22,51.22 134.97,51.46 134.97,58.13 v135.28,58.43 | 135.22,51.22 135.74,50.7 136,50.7 | LINEARMOTOR1.3 v135.03,63.97 134.97,63.9 | 135.22,51.22 135.22,51.18 v136,50.39 | v139.28,50.28 139.28,53.09 142,55.82 142,70.29 v142.3,70.29 | v140,74 146.37,74 JP1.1
N$13  (via drill 0.7)
  Top 0.5: v136.28,52 136.28,53.17 136.21,53.24 136.21,56.92 143.83,64.54 143.83,72.16 144.63,72.96 145.77,72.96 146.57,72.16 146.57,66.98 v147.28,66.28
  Bottom 0.5: v136.28,52 136.28,53.17 136.21,53.24 136.21,57.52 LINEARMOTOR1.6 | JP1.2 152.44,65.39 152.08,65.39 151.19,66.28 v147.28,66.28
N$14  (via drill 0.7)
  Top 0.5: v147,59 150.78,59 v150.89,58.89
  Bottom 0.5: JP1.3 154.5,60.79 154.86,60.79 155.74,59.91 155.74,58.65 154.86,57.77 152.08,57.77 150.96,58.89 v150.89,58.89 | LINEARMOTOR1.11 145.31,59 v147,59
N$15
  Bottom 0.5: JP1.4 152.43,59.28 LINEARMOTOR1.14
N$16  (via drill 0.7)
  Top 0.5: v133.36,10.96 132.81,10.41 v132.81,6.08
  Bottom 0.5: LINEARMOTOR2.3 133.36,17.26 v133.36,10.96 | JP2.1 152.85,18.83 153.21,18.83 155.09,16.95 155.09,11.2 146.9,3 134.38,3 132.81,4.57 v132.81,6.08
N$17  (via drill 0.7)
  Top 0.5: v134.11,5.11 134.11,9.11 v134.66,9.66
  Bottom 0.5: JP2.2 152.85,16.29 153.21,16.29 154.09,15.41 154.09,11.61 146.92,4.44 140.44,4.44 140,4 135.22,4 v134.11,5.11 | v134.66,9.66 134.66,10.94 LINEARMOTOR2.6
N$18
  Bottom 0.5: JP2.3 146.12,14.78 LINEARMOTOR2.11
N$19  (via drill 0.7)
  Top 0.5: v149,13.48 149,18 v147,20
  Bottom 0.5: JP2.4 149.76,12.24 149,13 v149,13.48 | v147,20 144.74,20 LINEARMOTOR2.14
N$20  (via drill 0.7)
  Top 0.5: v48,43 v51,43
  Bottom 0.5: 52.42,43.29 TANKTRACKMOTORS.3 51.51,43.51 v51,43 | JP3.1 47.71,43.29 v48,43
N$21
  Bottom 0.5: JP3.2 47.78,40.75 TANKTRACKMOTORS.6
N$22
  Bottom 0.5: TANKTRACKMOTORS.11 55.32,35.89 55.01,35.59 55.01,31.24 53.21,29.44 52.07,29.44 51.27,30.24 51.27,31 47.09,35.17 47.09,36.3 46.21,37.18 45.85,37.18 JP3.3
N$23  (via drill 0.7)
  Top 0.5: v57,34 57,41.7 v58.3,43
  Bottom 0.5: v57,34 56.01,33.01 56.01,30.83 53.62,28.44 51.66,28.44 50.27,29.83 50.27,30.22 JP3.4 | v58.3,43 58.81,43.51 TANKTRACKMOTORS.14
N$24
  Bottom 0.5: JP5.1 129.75,39.19 LINEARMOTOR.23
N$25
  Bottom 0.5: JP5.2 129.75,41.73 LINEARMOTOR.24
N$26
  Bottom 0.5: JP5.3 129.75,44.27 LINEARMOTOR.25
N$27
  Bottom 0.5: JP5.4 129.75,46.81 LINEARMOTOR.26
N$28
  Bottom 0.5: JP9.2 89.55,46.46 MOTORNEXTRASENSOR.25
N$29
  Bottom 0.5: JP9.3 89.55,49 MOTORNEXTRASENSOR.26
N$30  (via drill 0.7)
  Top 0.5: v83.7,21 84,20.7 v84,18.09
  Bottom 0.5: MOTORNEXTRASENSOR.14 81.61,21 v83.7,21 | v84,18.09 94.72,18.09 JP10.1
N$31
  Bottom 0.5: MOTORNEXTRASENSOR.15 94.9,20.81 JP10.2
N$32
  Bottom 0.5: MOTORNEXTRASENSOR.16 94.9,23.35 JP10.3
N$33
  Bottom 0.5: MOTORNEXTRASENSOR.17 94.9,25.89 JP10.4
N$34
  Bottom 0.5: MOTORNEXTRASENSOR.18 94.9,28.43 JP10.5
N$35
  Bottom 0.5: JP9.4 89.55,51.54 MOTORNEXTRASENSOR.27
N$36
  Bottom 0.5: JP9.5 96.75,53.83 MOTORNEXTRASENSOR.28
N$37  (via drill 0.7)
  Top 0.5: v52,79.46 58.54,79.46 v59,79
  Bottom 0.5: 9V.+ 39.77,76.85 D1.C 42.38,79.46 v52,79.46 51.8,79.25 51.8,69.29 49.79,67.28 38.8,67.28 38.08,68 32.36,68 21.86,57.5 21,57.5 21,38 20,37 19.98,37 19.8,37.19 17.16,37.19 16,36.03 16,22.36 15.5,21.86 15.5,18.14 18.14,15.5 18.31,15.5 R4.P$2 21,13 | IC1.1 77.46,81.29 77,81.75 63.39,81.75 62.49,80.85 62.49,80.49 IC2.1 61,79 v59,79
N$38
  Bottom 0.5: MOTORNEXTRASENSOR.19 94.9,30.97 JP10.6
N$40
  Bottom 0.5: R4.P$1 6.2,13 5.73,13.47 LED1.A
N$41
  Bottom 0.5: SW4.1 8.37,59.88 6.96,61.28 6.96,63.77 9,65.81 12V1.- 9.31,71.77 9V.- 25.29,72 36,72 38.2,69.8 38.2,69.29 39.21,68.28 40.63,68.28 42.35,70 D2.A D1.A
PWM1  (via drill 0.7)
  Top 0.5: v132.21,66.8 131.78,66.8 128.53,63.55 122.55,63.55 122,63 121.7,62.7 v121.7,62
  Bottom 0.5: LINEARMOTOR1.1 132.78,66.8 v132.21,66.8 | v121.7,62 121.7,45.3 122,45 121.67,44.67 LINEARMOTOR.5
PWM2  (via drill 0.7)
  Top 0.5: v117,28.93 117,20 122.24,20 123.55,18.7 127.12,18.7 130.3,21.89 130.3,32.3 136,38 136.29,38 136.61,37.68 139.39,37.68 139.71,38 143,38 v143,36
  Bottom 0.5: LINEARMOTOR1.9 143,51.61 v143,36 | v117,28.93 117.3,29.23 117.61,29.23 117.81,29.43 LINEARMOTOR.11
PWM3  (via drill 0.7)
  Top 0.5: v124.08,20 124.48,20.39 127.4,20.39 128.23,21.22 128.23,24.94 128.08,25.08 128.66,25.66 v129,25.66
  Bottom 0.5: LINEARMOTOR.12 123.5,26.89 124.39,26 124.39,20.3 v124.08,20 | v129,25.66 136.54,25.66 LINEARMOTOR2.1
PWM4
  Bottom 0.5: LINEARMOTOR2.9 144.04,8 138,8 137.98,7.98 137.98,7.24 137.18,6.44 136.04,6.44 131,11.48 131,17.62 LINEARMOTOR.15
PWM21  (via drill 0.7)
  Top 0.5: v57.11,49.89 58.18,49.89 59.25,50.96 61.24,50.96 64.1,48.1 65.26,48.1 65.46,48.3 66.54,48.3 67.3,47.54 67.3,46.46 66.54,45.7 65.91,45.7 v65.61,45.39
  Bottom 0.5: TANKTRACKMOTORS.1 54.16,47.07 54.93,47.07 56,48.15 56,48.41 57.11,49.53 v57.11,49.89 | v65.61,45.39 66.19,45.39 66.38,45.21 79.88,45.21 MOTORNEXTRASENSOR.5
PWM22
  Bottom 0.5: MOTORNEXTRASENSOR.11 75.84,28.43 75.33,27.92 63.15,27.92 TANKTRACKMOTORS.9
RESET  (via drill 0.7)
  Top 0.5: v84,64.61 83.7,64.3 49.51,64.3 48.2,63 30,63 29.58,62.58 29.58,41.35 27,38.77 v27,16
  Bottom 0.5: LINEARMOTOR.1 SW3.P$2 109.59,54.82 105.91,58.5 105,58.5 105,58.64 106.5,60.14 106.5,63.86 103.86,66.5 100.14,66.5 98.24,64.61 v84,64.61 | v27,16 27,13.24 R3.P$1
RESET1  (via drill 0.7)
  Top 0.5: v56.35,54.35 v54,52 | v23,34 20.72,34 19.31,32.59 4.2,32.59 v3.61,32
  Bottom 0.5: MOTORNEXTRASENSOR.1 81.25,54 SW7.P$2 71.61,54 69.59,51.98 58.28,51.98 56.13,54.13 v56.35,54.35 | v54,52 25,52 24,51 24,36.76 23,35.76 v23,34 | R5.P$1 5,9.42 3.31,11.11 3.31,22.99 3.61,23.29 v3.61,32
RXD  (via drill 0.7)
  Top 0.5: 19,36 19,36.42 | 19,36.42 19.3,36.12 v19.3,35.84 | U7.5 15.76,39.51 16.86,39.51 18.25,38.13 18.25,37.18 19,36.42
  Bottom 0.5: v19.3,35.84 20.07,35.07 | 20.07,35.07 37.14,18 43.46,18 SW2.3 | SW1.3 30.61,61.61 22,53 22,37.59 20.07,35.66 20.07,35.07
RXD1  (via drill 0.7)
  Top 0.5: v82,55.7 97.27,55.7 97.37,55.6 99.21,55.6 v99.41,55.41 | v107,51 107.01,50.99 v115.7,50.99
  Bottom 0.5: SW1.2 55.96,60.48 55.84,60.48 55.02,59.65 55.02,58.49 55.84,57.66 78.09,57.66 79,56.75 79.11,56.75 79.86,56 81.7,56 v82,55.7 | LINEARMOTOR.3 117.39,51.29 117.33,51.22 116.38,51.22 116.14,50.99 v115.7,50.99 | 102,56.5 102.25,56.25 | 102.25,56.25 102.96,55.54 102.96,53.98 105.94,51 v107,51 | 102.25,56.25 102.2,56.3 100.3,56.3 v99.41,55.41 | 102.25,56.25
RXD2  (via drill 0.7)
  Top 0.5: v62.54,24.62 62.54,25.28 64,26.74 64,28.43 v64.8,29.22
  Bottom 0.5: SW2.2 55.09,17.17 v62.54,24.62 | v64.8,29.22 64.61,29.42 64.61,30.54 64.3,30.84 64.3,48 65.05,48.75 MOTORNEXTRASENSOR.3
SCL
  Bottom 0.5: JP4.3 125.36,56.28 LINEARMOTOR.28
SDA
  Bottom 0.5: JP4.4 127.9,55.74 128.23,55.42 128.23,53.71 LINEARMOTOR.27
TXD  (via drill 0.7)
  Top 0.5: 18,36.01 18,36 | U7.6 15.76,38.24 16.72,38.24 17.25,37.71 17.25,36.76 18,36.01 | v17.7,35.88 17.82,36.01 | 17.82,36.01 18,36.01 | 17.82,36.01 18,35.83 18,35.3 18.76,34.53 19.84,34.53 20.67,35.36 v21.62,35.36
  Bottom 0.5: SW2.4 46.34,12.58 46.23,12.58 45.4,13.41 45.4,14 42.4,17 36.73,17 19.19,34.53 18.76,34.53 18,35.3 18,35.58 v17.7,35.88 | SW1.4 30.07,59.07 23,52 23,37.17 21.62,35.79 v21.62,35.36
TXD1  (via drill 0.7)
  Top 0.5: v84,57 97.81,57 v97.91,56.91
  Bottom 0.5: SW1.1 78.2,59.07 79.14,58.14 79.77,57.5 80.27,57 v84,57 | LINEARMOTOR.2 110.71,52.29 105.5,57.5 98.5,57.5 v97.91,56.91
TXD2  (via drill 0.7)
  Top 0.5: v63.3,30 63,29.7 63,27.16 60.94,25.09 v60.94,24.93
  Bottom 0.5: MOTORNEXTRASENSOR.2 80.13,50 64,50 63.3,49.3 v63.3,30 | v60.94,24.93 53.02,17.02 53.02,13.41 54,12.43 54,11 54.64,11 SW2.1
VCC  (via drill 0.7)
  Top 0.5: U7.1 15.05,45.3 v13,45.3 6.94,45.3 v6.72,45.52 | v73.95,77 74.09,76.86 v82.14,76.86 95.45,76.86 v95.78,77.19 | v68.01,29.22 67.71,28.92 67.71,26.53 63.5,22.32 56.27,22.32 55.79,22.79 47.79,22.79 40,15 v38,15 | v123,39.59 123,37 v125,37 | v84.96,39.05 84.96,39.04 v88,36
  Bottom 0.5: 38,13.17 R3.P$2 34.81,12.91 34.81,11 | 38,13.17 40.13,13.17 100NF.1 | 34.81,11 R2.P$1 R1.P$2 | 34.81,11 34.5,11.31 12.49,11.31 11.99,11.81 R5.P$2 4.32,12.49 4.32,22.58 4.91,23.18 JP11.1 3.88,37.41 3.52,37.41 2.64,38.29 2.64,44.63 3.52,45.51 6.3,45.51 | 6.3,45.51 6.51,45.3 | MOTORNEXTRASENSOR.7 82.01,38.01 82.01,39.71 85.3,43 85.3,57.54 83,59.84 | MOTORNEXTRASENSOR.7 84.5,38.59 v84.96,39.05 | MOTORNEXTRASENSOR.21 89.3,36 | 89.3,36 MOTORNEXTRASENSOR.20 | LINEARMOTOR.7 v123,39.59 123,62.74 121.31,64.43 121.31,64.79 JP4.1 115,71.1 115,79 114.53,79.47 JP7.6 JP7.5 JP7.4 JP7.3 JP7.2 JP7.1 98.06,79.47 v95.78,77.19 | LINEARMOTOR.20 LINEARMOTOR.21 125.05,37.05 v125,37 | 82.47,77.19 v82.14,76.86 81.25,75.97 81.25,61.59 83,59.84 | v73.95,77 69,77 IC2.3 | 83,60 83,59.84 | MOTORNEXTRASENSOR.7 70.59,38.59 68,36 68,29.24 v68.01,29.22 | v38,15 38,13.17 | v6.72,45.52 v6.72,45.51 6.3,45.51 | v88,36 89.3,36